# EAGLE design Red_LED_PD (EAGLE 9.7.0)
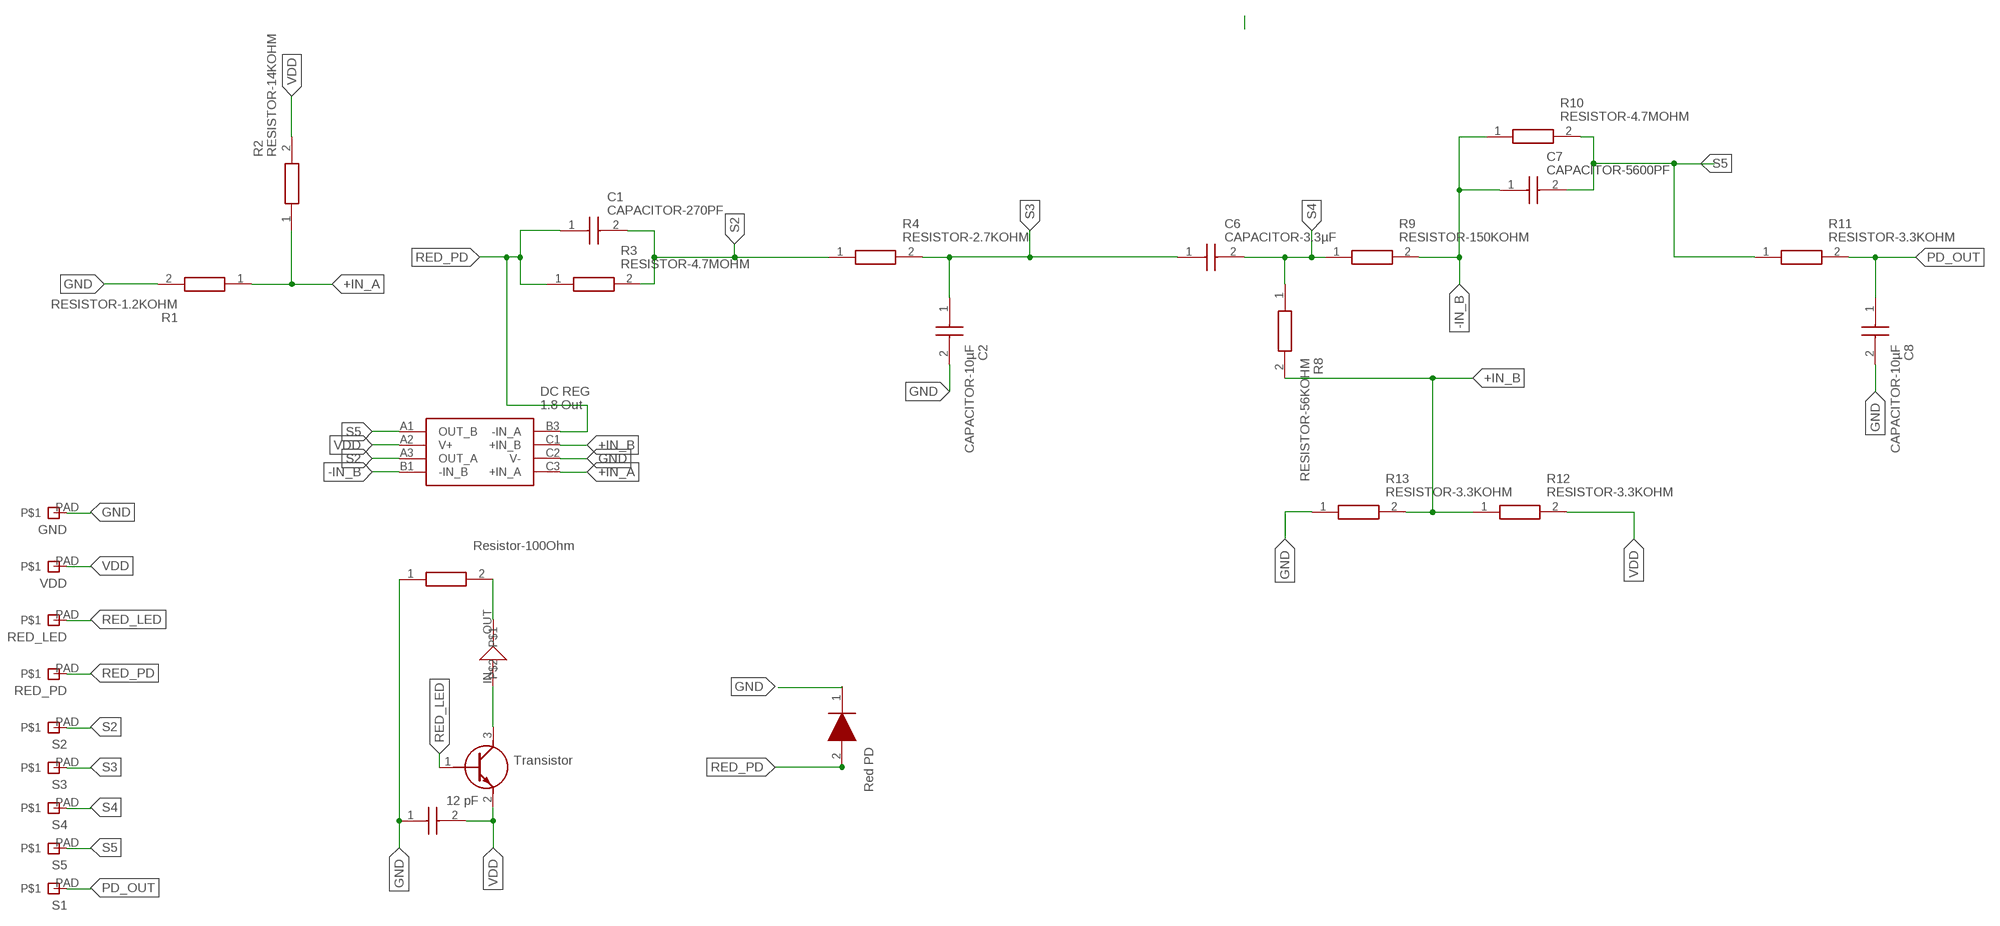
[diagram p0: schematic, sheet 1]

## Parts
C1  CAPACITOR-270PF  [CAPC1005X55N@1]
C2  CAPACITOR-10µF  [C0402]
C3  CAPACITOR-12PF  [CAPC1005X55N]
C6  CAPACITOR-3.3µF  [C0402]
C7  CAPACITOR-5600PF  [CAPC1005X55N@1]
C8  CAPACITOR-10µF  [C0402]
D1  REDPD  [SFH2713]
GND  PAD  [PAD]
IC1  ADA4505-2  [BGA8C50P3X3_142X142X65]
Q1  TRANSISTOR  [SOT883B]
R1  RESISTOR-1.2KOHM  [ERJPA2_(0402)]
R2  RESISTOR-14KOHM  [ERJ2RKD1004X]
R3  RESISTOR-4.7MOHM  [ERJ2RKD1004X]
R4  RESISTOR-2.7KOHM  [ERJPA2_(0402)]
R5  RESISTOR-100OHM  [RESC1608X55N]
R8  RESISTOR-56KOHM  [ERJ2RKD1004X]
R9  RESISTOR-150KOHM  [ERJS02_U02_(0402)]
R10  RESISTOR-4.7MOHM  [ERJ2RKD1004X]
R11  RESISTOR-3.3KOHM  [ERJPA2_(0402)]
R12  RESISTOR-3.3KOHM  [ERJPA2_(0402)]
R13  RESISTOR-3.3KOHM  [ERJPA2_(0402)]
RED_LED  PAD  [PAD]
RED_PD  PAD  [PAD]
S1  PAD  [PAD]
S2  PAD  [PAD]
S3  PAD  [PAD]
S4  PAD  [PAD]
S5  PAD  [PAD]
U$1  REDLED  [REDLED]
VDD  PAD  [PAD]

## Nets
+IN_A: IC1.C3(+IN_A) R1.1 R2.1
+IN_B: IC1.C1(+IN_B) R8.2 R12.1 R13.2
-IN_B: C7.1 IC1.B1(-IN_B) R9.2 R10.1
GND: C2.2 C3.1 C8.2 D1.1(K) GND.PAD IC1.C2(V-) R1.2 R5.1 R13.1
N$7: Q1.3(C) U$1.IN
N$13: R5.2 U$1.OUT
PD_OUT: C8.1 R11.2 S1.PAD
RED_LED: Q1.1(B) RED_LED.PAD
RED_PD: C1.1 D1.2(A) IC1.B3(-IN_A) R3.1 RED_PD.PAD
S2: C1.2 IC1.A3(OUT_A) R3.2 R4.1 S2.PAD
S3: C2.1 C6.1 R4.2 S3.PAD
S4: C6.2 R8.1 R9.1 S4.PAD
S5: C7.2 IC1.A1(OUT_B) R10.2 R11.1 S5.PAD
VDD: C3.2 IC1.A2(V+) Q1.2(E) R2.2 R12.2 VDD.PAD

## Library data of the parts
C1 = MABOS_Library:CAPACITOR-270PF: SMD Comm C0G, Ceramic, 270 pF, 2%, 50 VDC, 125 VDC, 125C, -55C, C0G, SMD, MLCC, Ultra-Stable, Low Loss, Class I, 0.1 % , 100 GOhms, 1.06 mg, 0402, 1mm, 0.5mm, 0.5mm, 0.3mm, 0.3mm, 10000, 78 Weeks, 120 Source: Datasheet <https://componentsearchengine.com/Datasheets/1/C0402C271G5GACTU.pdf>; DESCRIPTION: SMD Comm C0G, Ceramic, 270 pF, 2%, 50 VDC, 125 VDC, 125C, -55C, C0G, SMD, MLCC, Ultra-Stable, Low Loss, Class I, 0.1 % , 100 GOhms, 1.06 mg, 0402, 1mm, 0.5mm, 0.5mm, 0.3mm, 0.3mm, 10000, 78 Weeks, 120; HEIGHT: 0.55mm; MANUFACTURER_NAME: KEMET; MANUFACTURER_PART_NUMBER: C0402C271G5GACTU; MOUSER_PART_NUMBER: 80-C0402C271G5G; MOUSER_PRICE-STOCK: https://www.mouser.com/Search/Refine.aspx?Keyword=80-C0402C271G5G
C2 C8 = MABOS_Library:CAPACITOR-10µF: SMD Comm X5R, Ceramic, 10 uF, 20%, 6.3 VDC, 15.75 VDC, 85C, -55C, X5R, SMD, MLCC, Temperature Stable, Class II, 10 % , 10 MOhms, 1.41 mg, 0402, 1mm, 0.5mm, 0.5mm, 0.3mm, 0.3mm, 10000, 78 Weeks, 70 Source: Datasheet <https://content.kemet.com/datasheets/KEM_C1006_X5R_SMD.pdf>; DESCRIPTION: SMD Comm X5R, Ceramic, 10 uF, 20%, 6.3 VDC, 15.75 VDC, 85C, -55C, X5R, SMD, MLCC, Temperature Stable, Class II, 10 % , 10 MOhms, 1.41 mg, 0402, 1mm, 0.5mm, 0.5mm, 0.3mm, 0.3mm, 10000, 78 Weeks, 70; HEIGHT: 0.55mm; MANUFACTURER_NAME: KEMET; MANUFACTURER_PART_NUMBER: C0402C106M9PACTU; MOUSER_PART_NUMBER: 80-C0402C106M9P; MOUSER_PRICE-STOCK: https://www.mouser.co.uk/ProductDetail/KEMET/C0402C106M9PACTU?qs=x4XeXhDQKnp%252Bz0lMlwMC3A%3D%3D
C3 = MABOS_Library:CAPACITOR-12PF: 12 pF; DESCRIPTION: Multilayer Ceramic Capacitors MLCC - SMD/SMT 12pF 2% 25V C0G; HEIGHT: 0.55mm; MANUFACTURER_NAME: Kemet; MANUFACTURER_PART_NUMBER: C0402C120G3GACTU; MOUSER_PART_NUMBER: 80-C0402C120G3G; MOUSER_PRICE-STOCK: https://www.mouser.com/Search/Refine.aspx?Keyword=80-C0402C120G3G
C6 = MABOS_Library:CAPACITOR-3.3µF: SMD Comm X5R, Ceramic, 3.3 uF, 20%, 4 VDC, 10 VDC, 85C, -55C, X5R, SMD, MLCC, Temperature Stable, Class II, 10 % , 30.3 MOhms, 1.21 mg, 0402, 1mm, 0.5mm, 0.5mm, 0.3mm, 0.3mm, 10000, 78 Weeks, 70 Source: Datasheet <https://content.kemet.com/datasheets/KEM_C1006_X5R_SMD.pdf>; DESCRIPTION: SMD Comm X5R, Ceramic, 3.3 uF, 20%, 4 VDC, 10 VDC, 85C, -55C, X5R, SMD, MLCC, Temperature Stable, Class II, 10 % , 30.3 MOhms, 1.21 mg, 0402, 1mm, 0.5mm, 0.5mm, 0.3mm, 0.3mm, 10000, 78 Weeks, 70; HEIGHT: 0.55mm; MANUFACTURER_NAME: KEMET; MANUFACTURER_PART_NUMBER: C0402C335M7PACTU; MOUSER_PART_NUMBER: 80-C0402C335M7P; MOUSER_PRICE-STOCK: https://www.mouser.co.uk/ProductDetail/KEMET/C0402C335M7PACTU?qs=K%2Fj%2Fqf%252B0fqJuKSSbbJXSEQ%3D%3D
C7 = MABOS_Library:CAPACITOR-5600PF: SMD Comm X7R, Ceramic, 5600 pF, 5%, 16 VDC, 40 VDC, 125C, -55C, X7R, SMD, MLCC, Temperature Stable, Class II, 3.5 % , 100 GOhms, 1.21 mg, 0402, 1mm, 0.5mm, 0.5mm, 0.3mm, 0.3mm, 10000, 78 Weeks, 80 Source: Datasheet <https://content.kemet.com/datasheets/KEM_C1002_X7R_SMD.pdf>; DESCRIPTION: SMD Comm X7R, Ceramic, 5600 pF, 5%, 16 VDC, 40 VDC, 125C, -55C, X7R, SMD, MLCC, Temperature Stable, Class II, 3.5 % , 100 GOhms, 1.21 mg, 0402, 1mm, 0.5mm, 0.5mm, 0.3mm, 0.3mm, 10000, 78 Weeks, 80; HEIGHT: 0.55mm; MANUFACTURER_NAME: KEMET; MANUFACTURER_PART_NUMBER: C0402C562J4RACTU; MOUSER_PART_NUMBER: 80-C0402C562J4R; MOUSER_PRICE-STOCK: https://www.mouser.co.uk/ProductDetail/KEMET/C0402C562J4RACTU?qs=YJD0VjdmSUns5e35Blws8w%3D%3D
D1 = MABOS_Library:REDPD: Photodiodes Silicon PIN Photodiode Source: Datasheet <https://dammedia.osram.info/media/resource/hires/osram-dam-8960377/SFH 2713_EN.pdf>; DESCRIPTION: Photodiodes Silicon PIN Photodiode; HEIGHT: 0.7mm; MANUFACTURER_NAME: OSRAM; MANUFACTURER_PART_NUMBER: SFH 2713; MOUSER_PART_NUMBER: 720-SFH2713; MOUSER_PRICE-STOCK: https://www.mouser.co.uk/ProductDetail/OSRAM-Opto-Semiconductors/SFH-2713?qs=7MVldsJ5UayBhtoy5c4X7w%3D%3D
GND RED_LED RED_PD S1-S5 VDD = Nordic_BLE:PAD
IC1 = MABOS_Library:ADA4505-2: Op Amp (2); DESCRIPTION: ANALOG DEVICES - ADA4505-2ACBZ-R7 - OP-AMP, DUAL, 50KHZ, WLCSP-8; HEIGHT: 0.65mm; MANUFACTURER_NAME: Analog Devices; MANUFACTURER_PART_NUMBER: ADA4505-2ACBZ-R7; MOUSER_PART_NUMBER: 584-ADA4505-2ACBZ-R7; MOUSER_PRICE-STOCK: https://www.mouser.co.uk/ProductDetail/Analog-Devices/ADA4505-2ACBZ-R7?qs=BpaRKvA4VqEsLtXU3NSLDQ%3D%3D
Q1 = MABOS_Library:TRANSISTOR: Bipolar Transistors - BJT 45V NPN 100mA 250mW Source: Datasheet <https://componentsearchengine.com/Datasheets/1/BC847BMB,315.pdf>; DESCRIPTION: Bipolar Transistors - BJT 45V NPN 100mA 250mW; HEIGHT: mm; MANUFACTURER_NAME: Nexperia; MANUFACTURER_PART_NUMBER: BC847BMB,315; MOUSER_PART_NUMBER: 771-BC847BMB315; MOUSER_PRICE-STOCK: https://www.mouser.co.uk/ProductDetail/Nexperia/BC847BMB315?qs=5C9Q4QJFsuN7bUmIcU4LYw%3D%3D
R1 = MABOS_Library:RESISTOR-1.2KOHM: Anti-Surge Thick Film Chip Resistor, 0402, 0.2W Source: Datasheet <https://componentsearchengine.com/Datasheets/1/ERJ-PA2D1201X.pdf>; DESCRIPTION: Anti-Surge Thick Film Chip Resistor, 0402, 0.2W; HEIGHT: 0.4mm; MANUFACTURER_NAME: Panasonic; MANUFACTURER_PART_NUMBER: ERJ-PA2D1201X; MOUSER_PART_NUMBER: 667-ERJ-PA2D1201X; MOUSER_PRICE-STOCK: https://www.mouser.com/Search/Refine.aspx?Keyword=667-ERJ-PA2D1201X
R2 = MABOS_Library:RESISTOR-14KOHM: Panasonic ERJ2RK Series Thick Film Resistor 14k +/-1% 0.1W +/-100ppm/C Source: Datasheet <https://componentsearchengine.com/Datasheets/1/ERJ-2RKF1402X.pdf>; DESCRIPTION: Panasonic ERJ2RK Series Thick Film Resistor 14k +/-1% 0.1W +/-100ppm/C; HEIGHT: 0.4mm; MANUFACTURER_NAME: Panasonic; MANUFACTURER_PART_NUMBER: ERJ-2RKF1402X; MOUSER_PART_NUMBER: 667-ERJ-2RKF1402X; MOUSER_PRICE-STOCK: https://www.mouser.com/Search/ProductDetail.aspx?qs=MVjVSMjNRMrMgFTFLdW36A%3d%3d
R3 R10 = MABOS_Library:RESISTOR-4.7MOHM: Panasonic ERJ2GEJ Series Thick Film Surface Mount Fixed Resistor 0402 Case 4.7M +/-5% 0.1W -400 +150ppm/C Source: Datasheet <https://componentsearchengine.com/Datasheets/1/ERJ-2GEJ475X.pdf>; DESCRIPTION: Panasonic ERJ2GEJ Series Thick Film Surface Mount Fixed Resistor 0402 Case 4.7M +/-5% 0.1W -400 +150ppm/C; HEIGHT: 0.4mm; MANUFACTURER_NAME: Panasonic; MANUFACTURER_PART_NUMBER: ERJ-2GEJ475X; MOUSER_PART_NUMBER: 667-ERJ-2GEJ475X; MOUSER_PRICE-STOCK: https://www.mouser.com/Search/Refine.aspx?Keyword=667-ERJ-2GEJ475X
R4 = MABOS_Library:RESISTOR-2.7KOHM: Anti-Surge Thick Film Chip Resistor, 0402, 0.2W Source: Datasheet <http://industrial.panasonic.com/cdbs/www-data/pdf/RDO0000/AOA0000C331.pdf>; DESCRIPTION: Anti-Surge Thick Film Chip Resistor, 0402, 0.2W; HEIGHT: 0.4mm; MANUFACTURER_NAME: Panasonic; MANUFACTURER_PART_NUMBER: ERJ-PA2F2701X
R5 = MABOS_Library:RESISTOR-100OHM: Thick Film Resistors - SMD 100 OHM .1% 50PPM Source: Datasheet; DESCRIPTION: Thick Film Resistors - SMD 100 OHM .1% 50PPM; HEIGHT: 0.55mm; MANUFACTURER_NAME: KOA Speer; MANUFACTURER_PART_NUMBER: RS73G1JTTD1000B; MOUSER_PART_NUMBER: 660-RS73G1JTTD1000B; MOUSER_PRICE-STOCK: https://www.mouser.co.uk/ProductDetail/KOA-Speer/RS73G1JTTD1000B/?qs=GBLSl2AkiruQBcK7exZ%252Bcg%3D%3D
R8 = MABOS_Library:RESISTOR-56KOHM: Precision Thick Film Chip Resistor, 0402, 0.063W Source: Datasheet <https://componentsearchengine.com/Datasheets/1/ERJ-2RKF5602X.pdf>; DESCRIPTION: Precision Thick Film Chip Resistor, 0402, 0.063W; HEIGHT: 0.4mm; MANUFACTURER_NAME: Panasonic; MANUFACTURER_PART_NUMBER: ERJ-2RKF5602X; MOUSER_PART_NUMBER: 667-ERJ-2RKF5602X; MOUSER_PRICE-STOCK: https://www.mouser.com/Search/Refine.aspx?Keyword=667-ERJ-2RKF5602X
R9 = MABOS_Library:RESISTOR-150KOHM: Anti-Sulfurated Thick Film Chip Resistor, 0402, 0.1W Source: Datasheet <https://componentsearchengine.com/Datasheets/1/ERJ-U02D1503X.pdf>; DESCRIPTION: Anti-Sulfurated Thick Film Chip Resistor, 0402, 0.1W; HEIGHT: 0.4mm; MANUFACTURER_NAME: Panasonic; MANUFACTURER_PART_NUMBER: ERJ-U02D1503X; MOUSER_PART_NUMBER: 667-ERJ-U02D1503X; MOUSER_PRICE-STOCK: https://www.mouser.com/Search/Refine.aspx?Keyword=667-ERJ-U02D1503X
R11-R13 = MABOS_Library:RESISTOR-3.3KOHM: Anti-Surge Thick Film Chip Resistor, 0402, 0.2W Source: Datasheet <https://componentsearchengine.com/Datasheets/1/ERJ-PA2F3301X.pdf>; DESCRIPTION: Anti-Surge Thick Film Chip Resistor, 0402, 0.2W; HEIGHT: 0.4mm; MANUFACTURER_NAME: Panasonic; MANUFACTURER_PART_NUMBER: ERJ-PA2F3301X; MOUSER_PART_NUMBER: 667-ERJ-PA2F3301X; MOUSER_PRICE-STOCK: https://www.mouser.com/Search/Refine.aspx?Keyword=667-ERJ-PA2F3301X
U$1 = MABOS_Library:REDLED

## Board
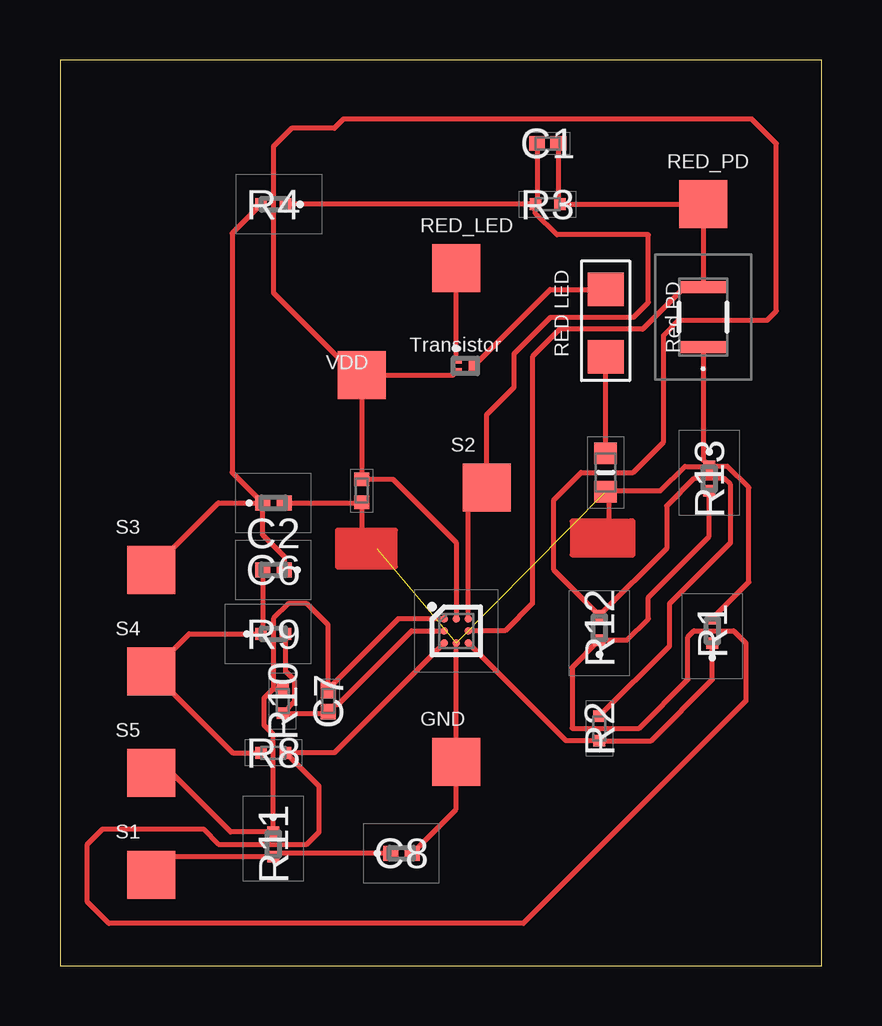
[diagram p1: board, top side]

Size 31.73 x 37.77 mm. Coordinates in mm from the lower left corner, seen from the top.
Outline: 0,0 31.73,0 31.73,37.77 0,37.77 0,0
Copper layers (1*16): Top / Bottom
Stack-up Default Layer Stack: Top User Defined 0.035mm / Dielectric-1 User Defined 1.5mm / Bottom User Defined 0.035mm
Design rules "default": minimum track width 6mil, minimum drill 0.35mm, track to track 6mil, track to pad 6mil, pad to pad 6mil, via to via 6mil, smd to smd 6mil, copper to edge 40mil, drill to drill 6mil, minimum pad ring 10mil, minimum via ring 8mil, stop-mask expansion 4mil, vias tented up to drill 0mil, thermal gap 10mil

### Footprints (pad centres in the part's own frame; a part is rotated, then mirrored left to right if it is on the bottom)
CAPC1005X55N@1 = smd 0.65 x 0.62: 1 -0.44,0; 2 0.44,0
C0402 = smd 0.62 x 0.62: 1 -0.45,0; 2 0.45,0
CAPC1005X55N = smd 0.56 x 0.62: 1 -0.48,1.27; 2 0.48,1.27
SFH2713 = smd 0.5 x 1.9: 1 -1.25,0; 2 1.25,0
PAD = smd 2 x 2: PAD 0,0
BGA8C50P3X3_142X142X65 = smd 0.306 x 0.306: A1 -0.5,0.5; A2 0,0.5; A3 0.5,0.5; B1 -0.5,0; B3 0.5,0; C1 -0.5,-0.5; C2 0,-0.5; C3 0.5,-0.5
SOT883B = smd 0.4 x 0.25: 1 -0.35,0.225; 2 -0.35,-0.225 | smd 0.4 x 0.7: 3 0.35,0
ERJPA2_(0402) = smd 0.475 x 0.5: 1 -0.512,0; 2 0.512,0
ERJ2RKD1004X = smd 0.475 x 0.5: 1 -0.512,0; 2 0.512,0
RESC1608X55N = smd 0.9 x 0.95: 1 -0.8,0; 2 0.8,0
ERJS02_U02_(0402) = smd 0.475 x 0.5: 1 -0.512,0; 2 0.512,0
REDLED = smd 1.4 x 1.5: IN 2.8,0; OUT 0,0

### Placement (x,y rotation side)
C1  20.32,34.29 180 top
C2  8.89,19.3 0 top
C3  13.84,19.81 90 top
C6  8.89,16.51 180 top
C7  11.18,11.05 90 top
C8  14.22,4.7 0 top
D1  26.8,27.05 90 top
GND  16.51,8.51 0 top
IC1  16.51,13.97 0 top
Q1  16.89,25.02 0 top
R1  27.18,13.97 90 top
R2  22.48,9.91 90 top
R3  20.32,31.75 180 top
R4  8.89,31.75 180 top
R5  22.73,20.57 90 top
R8  8.89,8.89 0 top
R9  8.89,13.84 0 top
R10  9.27,11.05 90 top
R11  8.89,5.08 270 top
R12  22.48,14.1 90 top
R13  27.05,20.32 270 top
RED_LED  16.51,29.08 0 top
RED_PD  26.8,31.75 0 top
S1  3.81,3.81 0 top
S2  17.78,19.94 0 top
S3  3.81,16.51 0 top
S4  3.81,12.28 0 top
S5  3.81,8.04 0 top
U$1  22.73,25.4 90 top
VDD  12.57,24.64 0 top

### Tracks (layer width: path | path; a pad name or v marks a point on that pad's centre or on a via)
+IN_A
  Top 0.203: IC1.C3 21.09,9.39 R2.1 24.63,9.39 27.18,11.94 R1.1
+IN_B
  Top 0.203: IC1.C1 11.43,8.89 R8.2 10.79,7.5 10.79,5.59 10.29,5.08 6.6,5.08 5.97,5.71 1.78,5.71 1.14,5.08 1.14,2.67 2.03,1.78 19.3,1.78 28.57,11.05 28.57,13.46 28.07,13.97 26.42,13.97 26.16,13.72 26.16,11.94 24.13,9.91 21.34,9.91 21.34,12.44 R12.1 23.62,13.59 24.51,14.48 24.51,15.37 27.05,17.91 R13.2
-IN_B
  Top 0.203: IC1.B1 14.65,13.97 11.59,10.91 11.48,10.91 C7.1 11.1,10.54 R10.1 9.78,11.04 9.78,11.9 9.4,12.28 R9.2
GND  (3 unrouted)
  Top 0.203: IC1.C2 GND.PAD 16.51,6.54 C8.2 | D1.1 26.8,21.09 R13.1 | 22.77,19.81 25.02,19.81 26.04,20.83 R13.1 | R1.2 28.7,16.01 28.7,19.94 27.81,20.83 R13.1 | 12.7,18.03 12.7,18.16 13.97,18.16 13.97,16.64 11.56,16.64 11.56,18.16 12.57,18.16 C3.1 12.54,19.3 C2.2 | 12.7,18.03 11.81,18.03 | 11.81,18.03 11.68,18.03 11.68,16.76 13.84,16.76 13.84,18.03 12.7,18.03 | 11.81,18.03 11.81,16.89 13.72,16.89 13.72,17.91 11.94,17.91 11.94,17.02 13.59,17.02 13.59,17.78 12.06,17.78 12.06,17.14 13.46,17.14 13.46,17.65 12.19,17.65 12.19,17.27 13.34,17.27 13.34,17.53 12.32,17.53 12.32,17.4 13.21,17.4 | R5.1 22.86,19.65 22.86,18.54 | 22.86,18.54 23.75,18.54 | 23.75,18.54 23.88,18.54 23.88,17.14 21.34,17.14 21.34,18.54 22.86,18.54 | 23.75,18.54 23.75,17.27 21.46,17.27 21.46,18.41 23.62,18.41 23.62,17.4 21.59,17.4 21.59,18.29 23.5,18.29 23.5,17.53 21.72,17.53 21.72,18.16 23.37,18.16 23.37,17.65 21.84,17.65 21.84,18.03 23.24,18.03 23.24,17.91 | 23.24,17.91 23.24,17.78 21.97,17.78 21.97,17.91 23.24,17.91
N$7
  Top 0.203: Q1.3 20.42,28.2 U$1.IN
N$13
  Top 0.203: R5.2 U$1.OUT
PD_OUT
  Top 0.203: S1.PAD 4.57,4.57 R11.2 9.02,4.7 C8.1
RED_LED
  Top 0.203: Q1.1 16.51,25.28 RED_LED.PAD
RED_PD
  Top 0.203: C1.1 20.76,31.82 R3.1 26.67,31.75 | 26.67,31.75 RED_PD.PAD | 26.67,31.75 26.8,31.62 D1.2 26.04,28.3 24.28,26.54 20.83,26.54 19.68,25.4 19.68,15.11 18.54,13.97 IC1.B3
S2
  Top 0.203: IC1.A3 17.01,19.17 S2.PAD 17.78,22.99 18.92,24.13 18.92,25.53 20.45,27.05 23.9,27.05 24.51,27.66 24.51,30.48 20.7,30.48 19.81,31.37 R3.2 | R3.2 R4.1 | C1.2 19.88,31.82 R3.2
S3
  Top 0.203: C2.1 8.44,17.98 9.34,17.08 C6.1 | S3.PAD 6.6,19.3 C2.1 | C2.1 7.17,20.57 7.17,30.54 R4.2
S4
  Top 0.203: C6.2 8.44,13.91 R9.1 5.38,13.84 S4.PAD 7.2,8.89 R8.1
S5
  Top 0.203: IC1.A1 14.09,14.47 11.18,11.56 C7.2 11.18,14.22 10.29,15.11 9.53,15.11 8.89,14.48 8.89,11.56 | S5.PAD 4.66,8.04 7.11,5.59 R11.1 8.89,9.65 8.51,10.03 8.51,11.18 8.89,11.56 | 8.89,11.56 R10.2
VDD
  Top 0.203: IC1.A2 16.51,17.65 13.87,20.29 C3.2 12.57,24.38 | Q1.2 16.39,24.64 VDD.PAD 12.57,24.38 | R2.2 25.4,13.34 25.4,15.11 27.94,17.65 27.94,20.07 27.69,20.32 26.42,20.32 25.27,19.18 25.27,17.4 R12.2 20.57,16.52 20.57,19.43 21.72,20.57 23.88,20.57 25.15,21.84 25.15,26.29 25.78,26.92 29.46,26.92 29.84,27.31 29.84,34.29 28.83,35.31 11.81,35.31 11.43,34.92 9.65,34.92 8.89,34.16 8.89,28.07 12.57,24.38